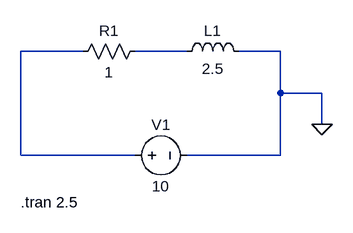
[diagram p0: schematic RL.asc]
RL.asc, the LTspice schematic file:
Version 4
SHEET 1 880 680
WIRE 48 176 -48 176
WIRE 208 176 128 176
WIRE 352 176 288 176
WIRE 352 240 352 176
WIRE 416 240 352 240
WIRE 416 288 416 240
WIRE -48 336 -48 176
WIRE 128 336 -48 336
WIRE 352 336 352 240
WIRE 352 336 208 336
FLAG 416 288 0
SYMBOL res 144 160 R90
WINDOW 0 0 56 VBottom 2
WINDOW 3 32 56 VTop 2
SYMATTR InstName R1
SYMATTR Value 1
SYMBOL ind 192 192 R270
WINDOW 0 32 56 VTop 2
WINDOW 3 5 56 VBottom 2
SYMATTR InstName L1
SYMATTR Value 2.5
SYMBOL voltage 112 336 R270
WINDOW 0 32 56 VTop 2
WINDOW 3 -32 56 VBottom 2
WINDOW 123 0 0 Left 0
WINDOW 39 0 0 Left 0
SYMATTR InstName V1
SYMATTR Value 10
TEXT -48 408 Left 2 !.tran 2.5

The netlist it stands for:
* RL.asc
R1 N002 N001 1
L1 N002 0 2.5
V1 N001 0 10
.tran 2.5
.backanno
.end